# EAGLE design PhotonHome (EAGLE 7.2.0)
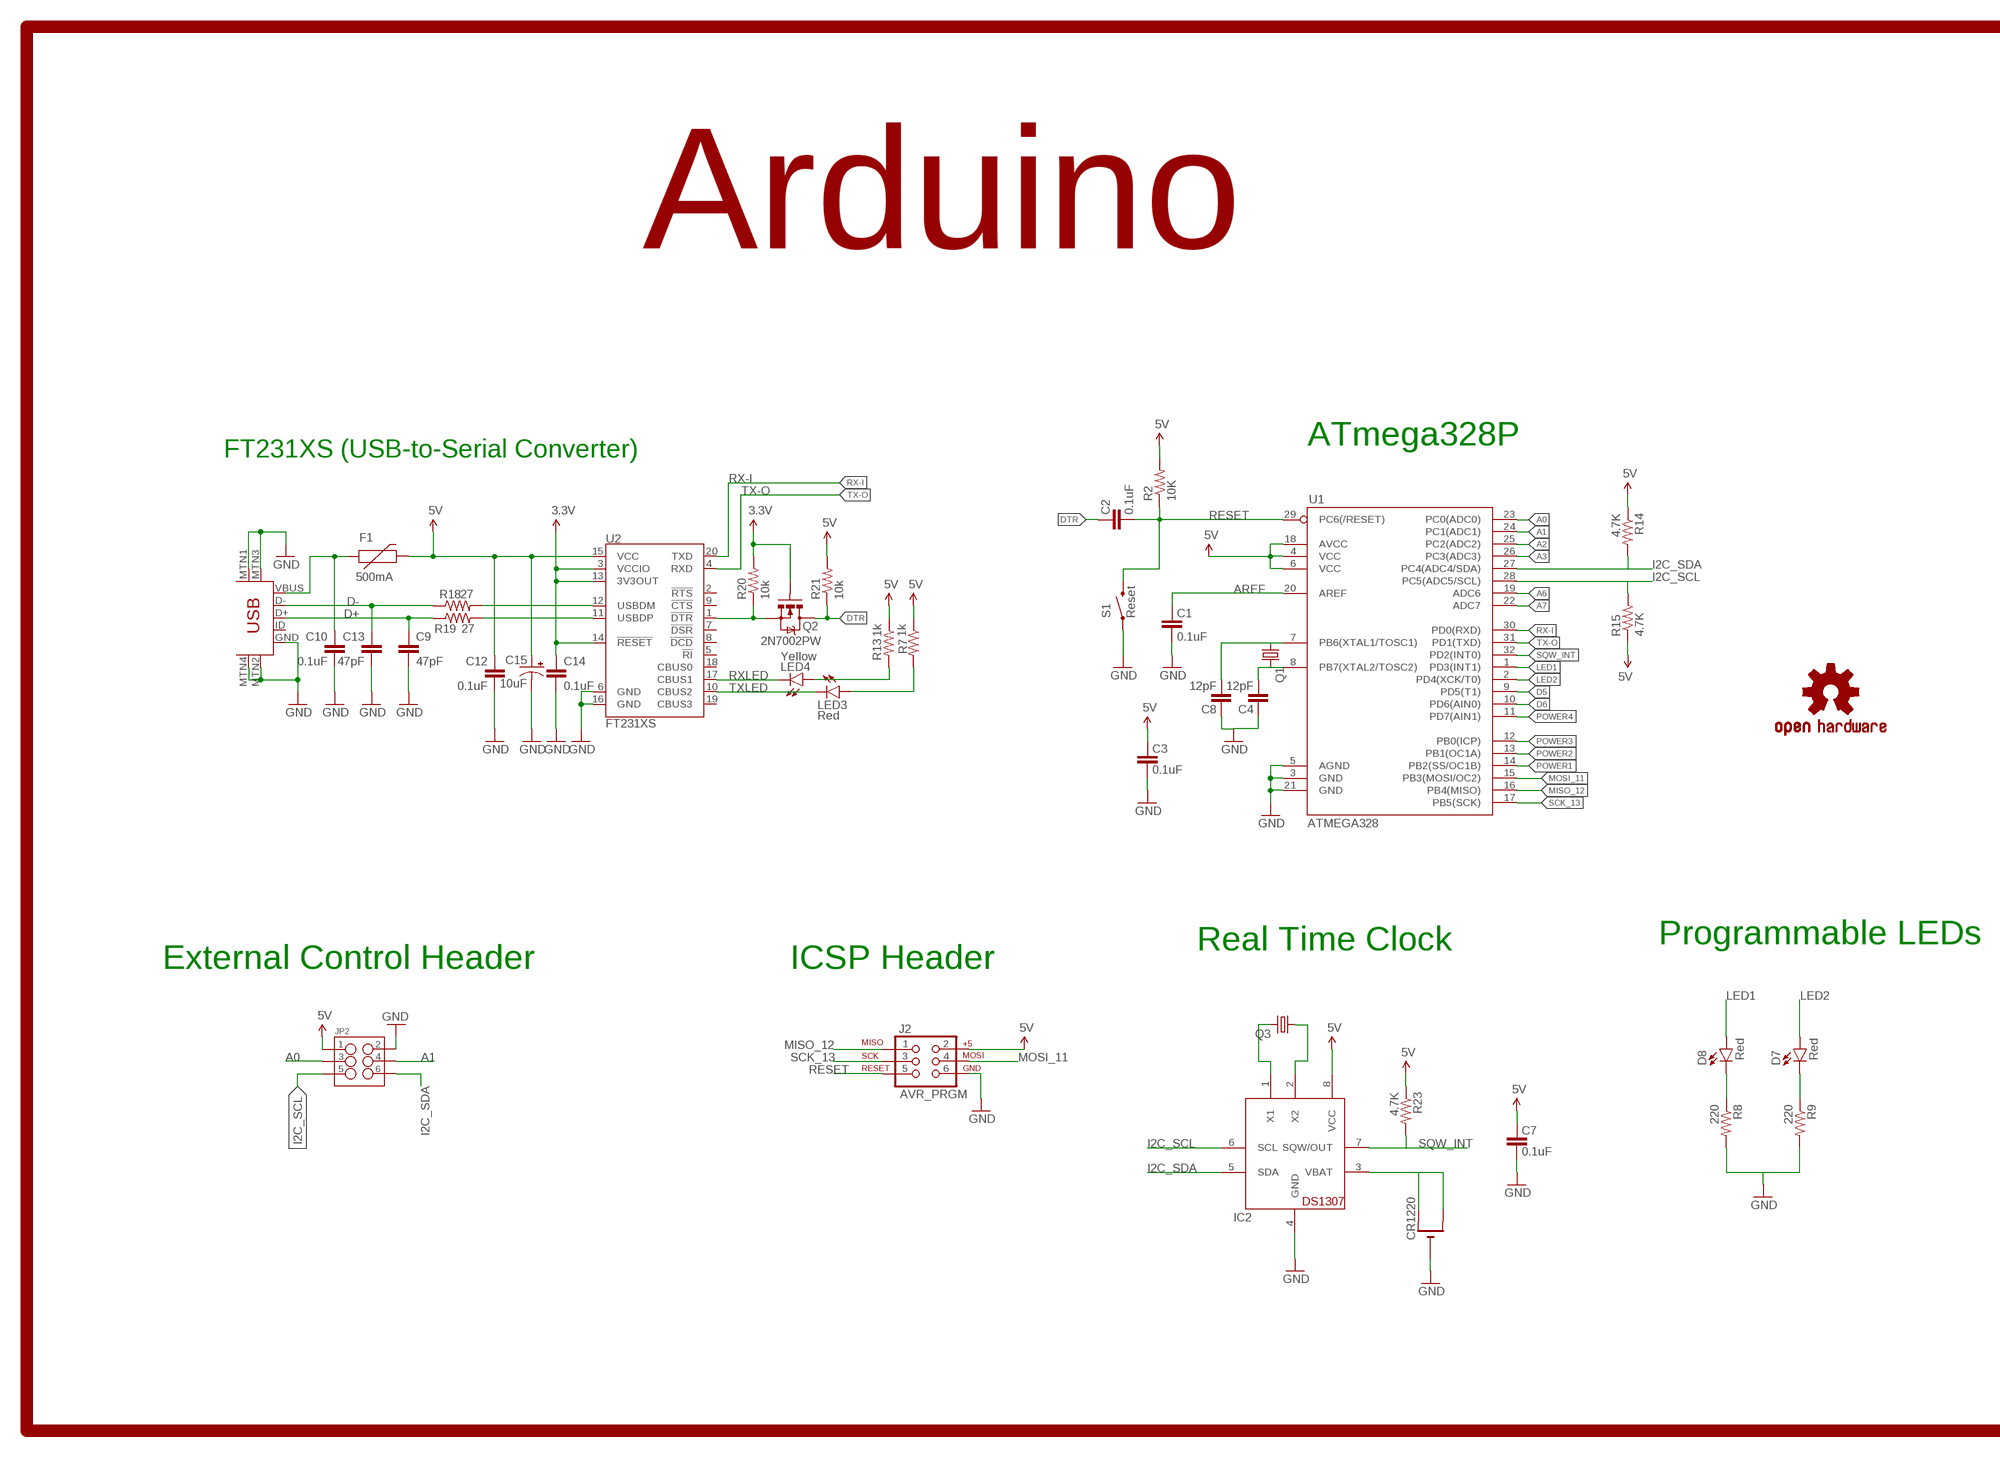
[diagram p0: schematic, sheet 1, part 1 of 2]
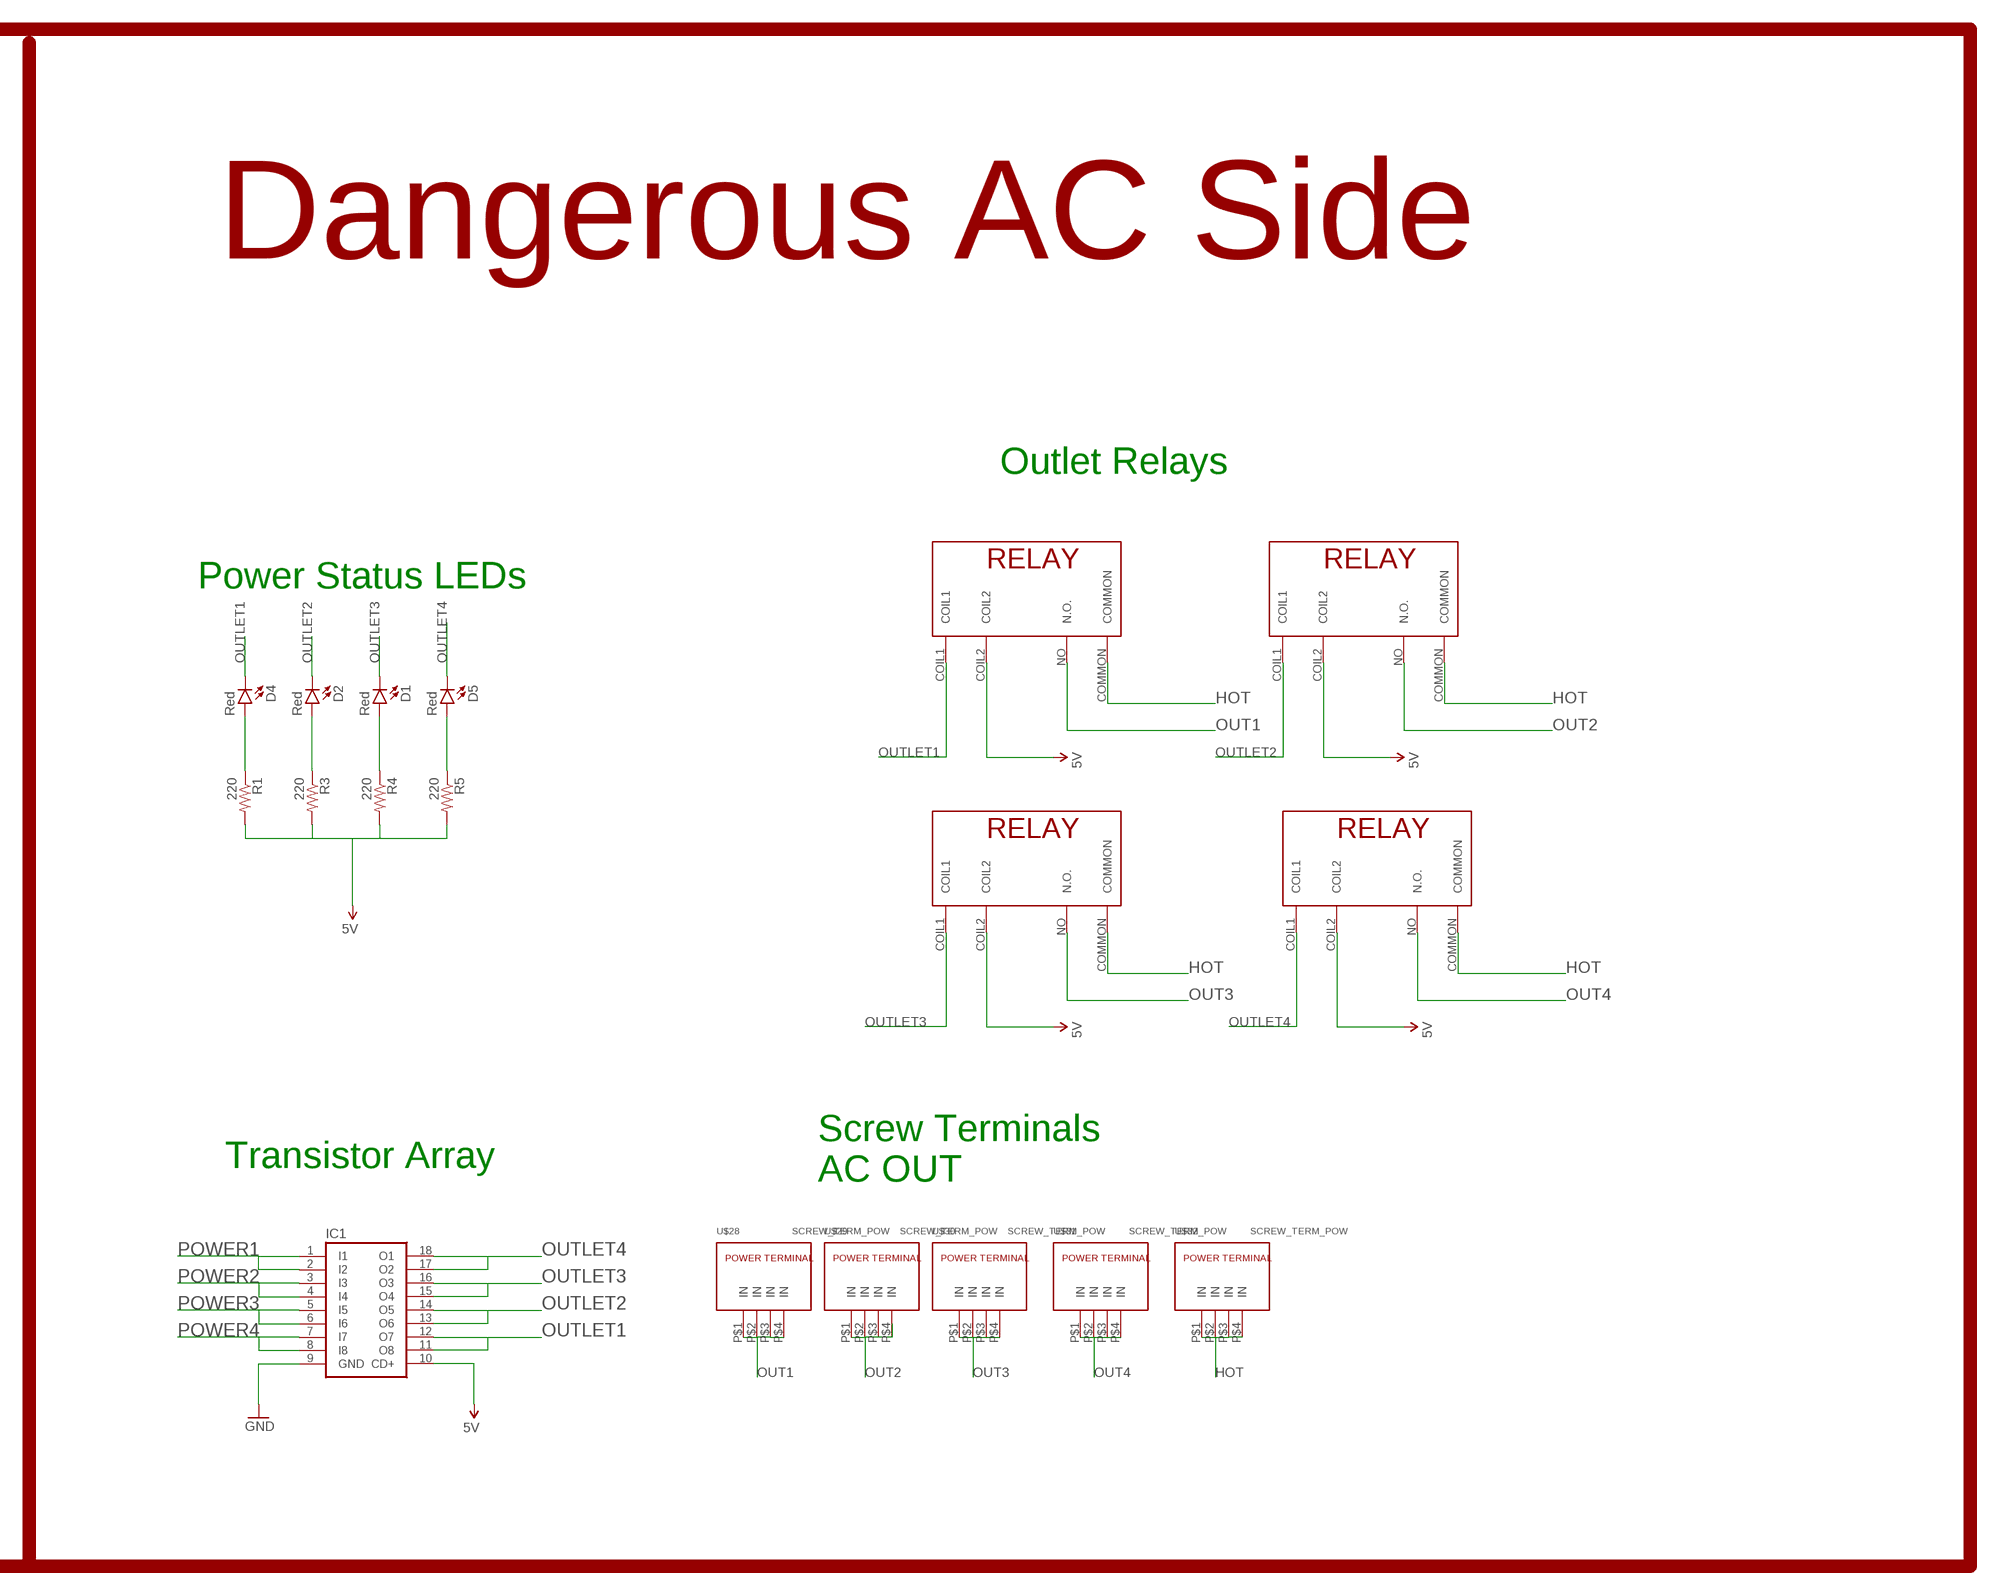
[diagram p1: schematic, sheet 1, part 2 of 2]

## Parts
C1  0.1uF  CAP0805-CAP  [0805-CAP]
C2  0.1uF  CAP0805-CAP  [0805-CAP]
C3  0.1uF  CAP0805-CAP  [0805-CAP]
C4  12pF  CAP0805-CAP  [0805-CAP]
C7  0.1uF  CAP0805-CAP  [0805-CAP]
C8  12pF  CAP0805-CAP  [0805-CAP]
C9  47pF  CAP0805-CAP  [0805-CAP]
C10  0.1uF  CAP0805-CAP  [0805-CAP]
C12  0.1uF  CAP0805-CAP  [0805-CAP]
C13  47pF  CAP0805-CAP  [0805-CAP]
C14  0.1uF  CAP0805-CAP  [0805-CAP]
C15  10uF  CAP_POL1206  [EIA3216]
CR1220  CR1220THM  [CR1220-THM]
D1  Red  LED-RED0805  [0805-LED]
D2  Red  LED-RED0805  [0805-LED]
D4  Red  LED-RED0805  [0805-LED]
D5  Red  LED-RED0805  [0805-LED]
D7  Red  LED-RED0805  [0805-LED]
D8  Red  LED-RED0805  [0805-LED]
F1  500mA  PTCSMD  [PTC-1206]
IC1  ULN2803ASOIC18-W  [SOIC18-W]
IC2  DS1307SO08  [SO08-150MIL]
J2  AVR_PRGM  AVR_SPI_PRG_6PTH  [2X3]
JP2  M03X2SHROUD  [2X3-SHROUDED]
LED3  Red  LED-RED0805  [0805-LED]
LED4  Yellow  LED-RED0805  [0805-LED]
MINIUSB  USB-MINIB-5PIN  [USB-MINIB]
Q1  CRYSTALHC49UP  [HC49UP]
Q2  2N7002PW  MOSFET-NCHANNEL2N7002PW  [SOT323]
Q3  CRYSTALTC38H  [TC38H]
R1  220  RES0805-RES  [0805]
R2  10K  RES0805-RES  [0805]
R3  220  RES0805-RES  [0805]
R4  220  RES0805-RES  [0805]
R5  220  RES0805-RES  [0805]
R7  1k  RES0805-RES  [0805]
R8  220  RES0805-RES  [0805]
R9  220  RES0805-RES  [0805]
R13  1k  RES0805-RES  [0805]
R14  4.7K  RES0805-RES  [0805]
R15  4.7K  RES0805-RES  [0805]
R18  27  RES0805-RES  [0805]
R19  27  RES0805-RES  [0805]
R20  10k  RES0805-RES  [0805]
R21  10k  RES0805-RES  [0805]
R23  4.7K  RES0805-RES  [0805]
RELAY1  RELAY_NO  [RELAY_G2RL-1A]
RELAY2  RELAY_NO  [RELAY_G2RL-1A]
RELAY3  RELAY_NO  [RELAY_G2RL-1A]
RELAY4  RELAY_NO  [RELAY_G2RL-1A]
S1  Reset  SWITCH-MOMENTARY-2SMD-ALT01  [TACTILE-SWITCH-SMD-ALT01]
U1  ATMEGA328  ATMEGA168  [TQFP32-08]
U2  FT231XS  [SSOP20_L]
U$3  OSHW-LOGOS  [OSHW-LOGO-S]
U$28  SCREW_TERM_POW  [SCREW-TERMINAL-POW]
U$29  SCREW_TERM_POW  [SCREW-TERMINAL-POW]
U$30  SCREW_TERM_POW  [SCREW-TERMINAL-POW]
U$31  SCREW_TERM_POW  [SCREW-TERMINAL-POW]
U$32  SCREW_TERM_POW  [SCREW-TERMINAL-POW]

## Nets
3.3V: C14.1 Q2.1(G) R20.2 U2.3(VCCIO) U2.13(3V3OUT) U2.14(!RESET)
5V: C3.2 C7.2 C12.1 C15.A(+) F1.2 IC1.10(CD+) IC2.8(VCC) J2.2 JP2.1 R1.2 R2.2 R3.2 R4.2 R5.2 R7.1 R13.1 R14.1 R15.1 R21.2 R23.1 RELAY1.COIL2 RELAY2.COIL2 RELAY3.COIL2 RELAY4.COIL2 U1.4(VCC) U1.6(VCC) U1.18(AVCC) U2.15(VCC)
A0: JP2.3 U1.23(PC0(ADC0))
A1: JP2.4 U1.24(PC1(ADC1))
A2: U1.25(PC2(ADC2))
A3: U1.26(PC3(ADC3))
A6: U1.19(ADC6)
A7: U1.22(ADC7)
AREF: C1.2 U1.20(AREF)
D5: U1.9(PD5(T1))
D6: U1.10(PD6(AIN0))
D+: C9.1 MINIUSB.D+ R19.1
D-: C13.1 MINIUSB.D- R18.1
DTR: C2.2 Q2.3(D) R21.1
GND [vcc]: C1.1 C3.1 C4.2 C7.1 C8.2 C9.2 C10.2 C12.2 C13.2 C14.2 C15.C(-) CR1220.- IC1.9(GND) IC2.4(GND) J2.6 JP2.2 MINIUSB.GND MINIUSB.MTN1(MTN2) MINIUSB.MTN2(MTN3) MINIUSB.MTN3(MTN1) MINIUSB.MTN4 R8.2 R9.2 S1.1 S1.2 U1.3(GND) U1.5(AGND) U1.21(GND) U2.6(GND) U2.16(GND)
HOT: RELAY1.COMMON RELAY2.COMMON RELAY3.COMMON RELAY4.COMMON U$32.P$1(IN) U$32.P$2(IN) U$32.P$3(IN) U$32.P$4(IN)
I2C_SCL: IC2.6(SCL) JP2.5 R15.2 U1.28(PC5(ADC5/SCL))
I2C_SDA: IC2.5(SDA) JP2.6 R14.2 U1.27(PC4(ADC4/SDA))
LED1: D8.1(A) U1.1(PD3(INT1))
LED2: D7.1(A) U1.2(PD4(XCK/T0))
MISO_12: J2.1 U1.16(PB4(MISO))
MOSI_11: J2.4 U1.15(PB3(MOSI/OC2))
N$1: C4.1 Q1.2 U1.8(PB7(XTAL2/TOSC2))
N$2: C8.1 Q1.1 U1.7(PB6(XTAL1/TOSC1))
N$4: LED3.1(A) R7.2
N$6: D4.1(A) R1.1
N$7: D2.1(A) R3.1
N$8: D1.1(A) R4.1
N$9: D5.1(A) R5.1
N$11: D8.2(C) R8.1
N$12: LED4.1(A) R13.2
N$13: R18.2 U2.12(USBDM)
N$14: D7.2(C) R9.1
N$16: R19.2 U2.11(USBDP)
N$17: Q2.2(S) R20.1 U2.1(!DTR)
N$22: IC2.1(X1) Q3.2
N$23: IC2.2(X2) Q3.1
N$27: CR1220.+1(+) CR1220.+2(+1) IC2.3(VBAT)
OUT1: RELAY1.NO(N.O.) U$28.P$1(IN) U$28.P$2(IN) U$28.P$3(IN) U$28.P$4(IN)
OUT2: RELAY2.NO(N.O.) U$29.P$1(IN) U$29.P$2(IN) U$29.P$3(IN) U$29.P$4(IN)
OUT3: RELAY3.NO(N.O.) U$30.P$1(IN) U$30.P$2(IN) U$30.P$3(IN) U$30.P$4(IN)
OUT4: RELAY4.NO(N.O.) U$31.P$1(IN) U$31.P$2(IN) U$31.P$3(IN) U$31.P$4(IN)
OUTLET1: D4.2(C) IC1.11(O8) IC1.12(O7) RELAY1.COIL1
OUTLET2: D2.2(C) IC1.13(O6) IC1.14(O5) RELAY2.COIL1
OUTLET3: D1.2(C) IC1.15(O4) IC1.16(O3) RELAY3.COIL1
OUTLET4: D5.2(C) IC1.17(O2) IC1.18(O1) RELAY4.COIL1
POWER1: IC1.1(I1) IC1.2(I2) U1.14(PB2(SS/OC1B))
POWER2: IC1.3(I3) IC1.4(I4) U1.13(PB1(OC1A))
POWER3: IC1.5(I5) IC1.6(I6) U1.12(PB0(ICP))
POWER4: IC1.7(I7) IC1.8(I8) U1.11(PD7(AIN1))
RESET: C2.1 J2.5 R2.1 S1.3 S1.4 U1.29(PC6(/RESET))
RX-I: U1.30(PD0(RXD)) U2.20(TXD)
RXLED: LED4.2(C) U2.17(CBUS1)
SCK_13: J2.3 U1.17(PB5(SCK))
SQW_INT: IC2.7(SQW/OUT) R23.2 U1.32(PD2(INT0))
TX-O: U1.31(PD1(TXD)) U2.4(RXD)
TXLED: LED3.2(C) U2.10(CBUS2)
VUSB: C10.1 F1.1 MINIUSB.VBUS
Unconnected: MINIUSB.ID U2.2(!RTS) U2.5(!RI) U2.7(!DSR) U2.8(!DCD) U2.9(!CTS) U2.18(CBUS0) U2.19(CBUS3)

## Notes on the sheet
- Arduino | Dangerous AC Side
- Outlet Relays
- ATmega328P
- FT231XS (USB-to-Serial Converter)
- Power Status LEDs
- Real Time Clock | Programmable LEDs
- External Control Header | ICSP Header
- Transistor Array
- Screw Terminals
  AC OUT

## Library data of the parts
C1-C4 C7-C10 C12-C14 = Terramus:CAP: CAP-08390
C15 = SparkFun-Capacitors:CAP_POL: Capacitor Polarized These are standard SMD and PTH capacitors. Normally 10uF, 47uF, and 100uF in electrolytic and tantalum varieties. Always verify the external diameter of the through hole cap, it varies with capacity, voltage, and manufacturer. The EIA devices should be standard.
CR1220 = Terramus:CR1220: CR1216/CR1220/CR1225 12mm 3V lithium coin cell Great for battery packup. Both SMT and THM holders. Note the THM package has the ground pads on both sides of the PCB so that the masks are the same - this reduces the cost
D1 D2 D4 D5 D7 D8 LED3 LED4 = Terramus:LED-RED: Assorted Red LEDs LilyPad 1206- DIO-09912 1206- DIO-00809 0603- DIO-00819
F1 = SparkFun:PTC: Resettable Fuse PTC Resettable Fuse. Spark Fun Electronics SKU : COM-08357
IC1 = Terramus:ULN2803A: DRIVER ARRAY
IC2 = Terramus:DS1307: DS1307 Real time clock (RTC) with battery backup ability. Talk to it via i2c
J2 = SparkFun-Connectors:AVR_SPI_PRG_6: AVR ISP 6 Pin This is the reduced ISP connector for AVR programming. Common on Arduino. This footprint will take up less PCB space and can be used with a 10-pin to 6-pin adapter such as SKU: BOB-08508 **Special note about "TEST_POINT" package. The stop mask is on the top side, so if you want your programming test points to be on the bottom of your board, make sure to place this package on the bottom side of the board. This also ensure that the orientation to program from the bottom side will be correct.
JP2 = Terramus:M03X2: 2x3 .1" header. Shrouded, with keying- CONN-10681 SMT- CONN-11415 Pogo pins- HW-11044; PROD_ID: CONN-10681
MINIUSB = SparkFun-Connectors:USB-MINIB: Mini-USB "B" connector with 5th pin broken out. Created new symbol breaking out 5th "ID" pin in mini/micro USB connector spec. See: http://en.wikipedia.org/wiki/Mini_usb#Cables. Uses same footprint as 4-pin symbol. Also added pins to connect to mounting / shield pads if required (probably not generally needed as signals aren't shielded once they leave the connector).
Q1 = adafruit:CRYSTAL: CRYSTAL; OC_FARNELL: unknown; OC_NEWARK: unknown
Q2 = SparkFun-DiscreteSemi:MOSFET-NCHANNEL: Common NMOSFET Parts MFG P/N Store ID Prod ID FDD8780 TRANS-09984 SI7820DN TRANS-11055 FDS6630A IC-08089 2N7002PW TRANS-11151 FQP30N06L COM-10213 TRANS-10060 BSS123LT1G TRANS-08345 BSS138 TRANS-00830 BS170 2N7000; PROD_ID: TRANS-11151
Q3 = Terramus:CRYSTAL: CRYSTAL; OC_FARNELL: unknown; OC_NEWARK: unknown
R1-R5 R7-R9 R13-R15 R18-R21 R23 = Terramus:RES: RES-00824
RELAY1-RELAY4 = Terramus:RELAY_NO
S1 = Testing:SWITCH-MOMENTARY-2: Various NO switches- pushbuttons, reed, etc
U1 = SparkFun:ATMEGA168
U2 = SparkFun-DigitalIC:FT231X: FTDI FT231X Full Speed USB to Full-handshake UART This USB2.0 Full Speed IC offers a compact bridge to full handshake UART interfaces. The device is a UART, capable of operating up to 3MBaud, with low power consumption (8mA). The FT231X includes the complete FT-X series feature set and enables USB to be added into a system design quickly and easily over a UART interface.
U$3 = SparkFun:OSHW-LOGO: Open Source Hardware Logo This logo indicates the piece of hardware it is found on incorporates a OSHW license and/or adheres to the definition of open source hardware found here: http://freedomdefined.org/OSHW
U$28-U$32 = Terramus:SCREW_TERM_POW

## Net classes
0 default: width 0.152 mm, drill 0.305 mm, clearance 0.152 mm
1 vcc: width 0.254 mm, clearance 0.205 mm to class 0, clearance 0.205 mm

## Board
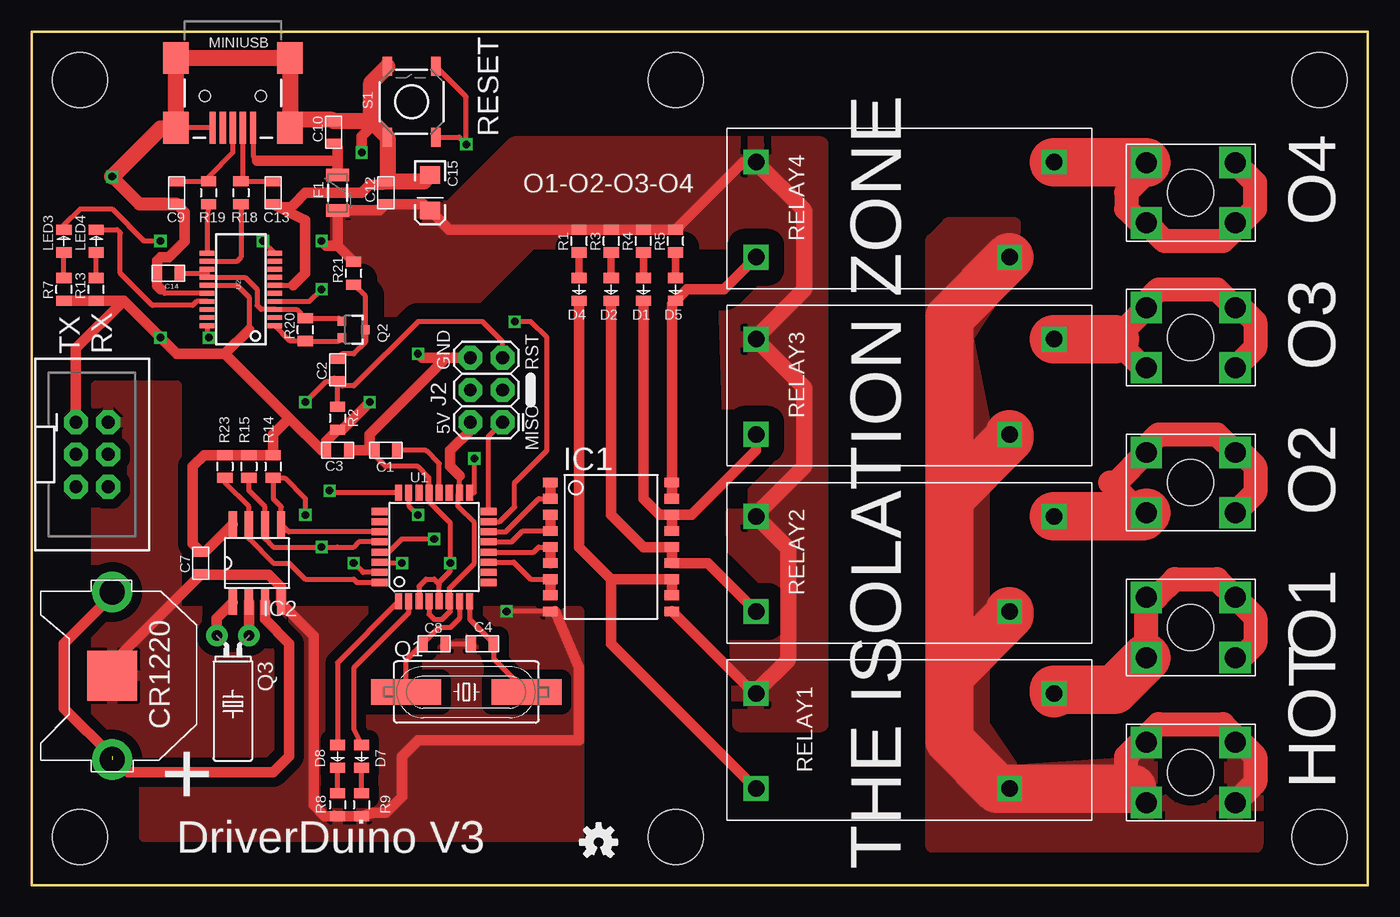
[diagram p2: board, top side]
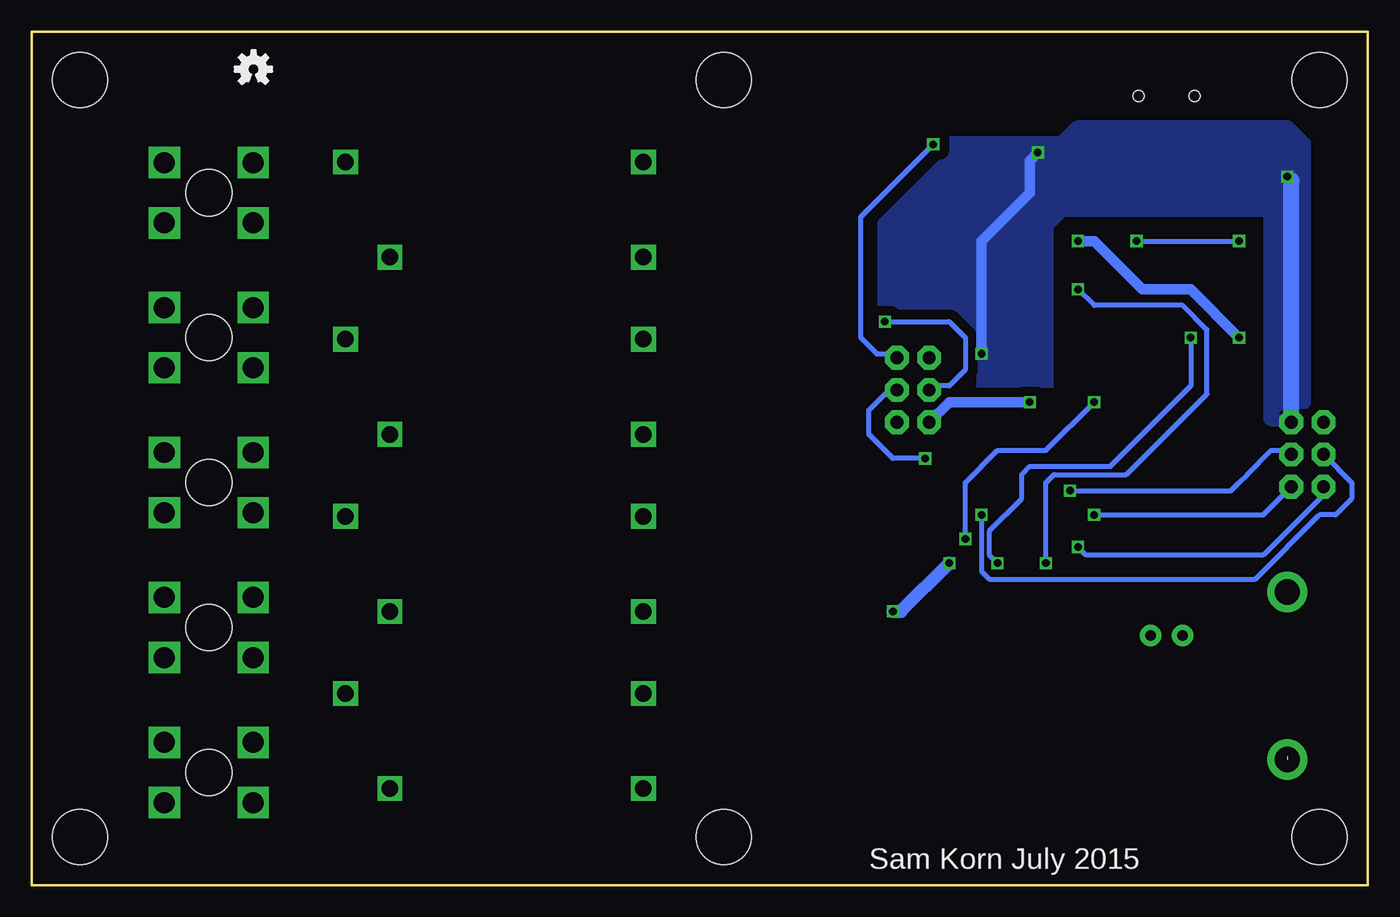
[diagram p3: board, bottom side, seen from below]

Size 105.41 x 67.31 mm. Coordinates in mm from the lower left corner, seen from the top.
Outline: 0,67.31 0,0 105.41,0 105.41,67.31 0,67.31
Copper layers (1*16): Top 0.0356mm / dielectric 1.5011mm / Bottom 0.0356mm
Design rules "LaenPCBOrder": minimum track width 6mil, minimum drill 13mil, track to track 6mil, track to pad 6mil, pad to pad 6mil, via to via 6mil, smd to smd 6mil, copper to edge 15mil, drill to drill 6mil, minimum pad ring 7mil, minimum via ring 7mil, stop-mask expansion 3mil, vias tented up to drill 0mil, thermal gap 10mil
Holes 4.34 mm at 50.8,3.81 50.8,63.5 3.81,63.5 3.81,3.81 101.6,63.5 101.6,3.81

### Footprints (pad centres in the part's own frame; a part is rotated, then mirrored left to right if it is on the bottom)
0805-CAP = smd 0.8 x 1.2: 1 -0.9,0; 2 0.9,0
EIA3216 = smd 1.4 x 1.6: A 1.4,0; C -1.4,0
CR1220-THM = drill 2 pad 3.175: +1 -6.604,0; +2 6.604,0 | smd 3.962 x 3.962: - 0,0
0805-LED = smd 0.8 x 1.2: 1 -0.9,0; 2 0.9,0
PTC-1206 = smd 1 x 1.8: 1 -1.4,0; 2 1.4,0
SOIC18-W = smd 0.762 x 1.143: 1 -5.08,-4.788; 2 -3.81,-4.788; 3 -2.54,-4.788; 4 -1.27,-4.788; 5 0,-4.788; 6 1.27,-4.788; 7 2.54,-4.788; 8 3.81,-4.788; 9 5.08,-4.788; 10 5.08,4.788; 11 3.81,4.788; 12 2.54,4.788; 13 1.27,4.788; 14 0,4.788; 15 -1.27,4.788; 16 -2.54,4.788; 17 -3.81,4.788; 18 -5.08,4.788
SO08-150MIL = smd 0.66 x 2.032: 1 -1.905,-3.073; 2 -0.635,-3.073; 3 0.635,-3.073; 4 1.905,-3.073; 5 1.905,3.073; 6 0.635,3.073; 7 -0.635,3.073; 8 -1.905,3.073
2X3 = drill 1.016 pad 1.88 octagon: 1 0,0; 2 0,2.54; 3 2.54,0; 4 2.54,2.54; 5 5.08,0; 6 5.08,2.54
2X3-SHROUDED = drill 1.016 pad 1.88 octagon: 1 -1.27,2.54; 2 1.27,2.54; 3 -1.27,0; 4 1.27,0; 5 -1.27,-2.54; 6 1.27,-2.54
USB-MINIB = smd 2.5 x 0.5: D+ 2.5,0; D- 2.5,0.8; GND 2.5,-1.6; ID 2.5,-0.8; VBUS 2.5,1.6 | smd 2.5 x 2: MTN1 -3,4.5; MTN2 2.5,4.5; MTN3 -3,-4.5; MTN4 2.5,-4.5 | hole 0.9: 0,2.2; 0,-2.2
HC49UP = smd 5.5 x 2: 1 -4.75,0; 2 4.75,0
SOT323 = smd 0.7 x 0.7: 1 -0.65,-0.925; 2 0.65,-0.925; 3 0,0.925
TC38H = drill 0.813 pad 1.676: 1 -1.27,0; 2 1.27,0
0805 = smd 0.8 x 1.2: 1 -0.9,0; 2 0.9,0
RELAY_G2RL-1A = drill 1.3 square: COIL1 0,0; COIL2 0,7.5; COMMON 20,0; NO 23.5,7.5
TACTILE-SWITCH-SMD-ALT01 = smd 1.524 x 0.762: 1 -2.794,1.905; 2 2.794,1.905; 3 -2.794,-1.905; 4 2.794,-1.905
TQFP32-08 = smd 1.27 x 0.559: 1 -4.293,2.8; 2 -4.293,2; 3 -4.293,1.2; 4 -4.293,0.4; 5 -4.293,-0.4; 6 -4.293,-1.2; 7 -4.293,-2; 8 -4.293,-2.8; 17 4.293,-2.8; 18 4.293,-2; 19 4.293,-1.2; 20 4.293,-0.4; 21 4.293,0.4; 22 4.293,1.2; 23 4.293,2; 24 4.293,2.8 | smd 0.559 x 1.27: 9 -2.8,-4.293; 10 -2,-4.293; 11 -1.2,-4.293; 12 -0.4,-4.293; 13 0.4,-4.293; 14 1.2,-4.293; 15 2,-4.293; 16 2.8,-4.293; 25 2.8,4.293; 26 2,4.293; 27 1.2,4.293; 28 0.4,4.293; 29 -0.4,4.293; 30 -1.2,4.293; 31 -2,4.293; 32 -2.8,4.293
SSOP20_L = smd 0.381 x 1.143: 1 -2.857,-2.68; 2 -2.223,-2.68; 3 -1.587,-2.68; 4 -0.953,-2.68; 5 -0.318,-2.68; 6 0.318,-2.68; 7 0.953,-2.68; 8 1.587,-2.68; 9 2.223,-2.68; 10 2.857,-2.68; 11 2.857,2.68; 12 2.223,2.68; 13 1.587,2.68; 14 0.953,2.68; 15 0.318,2.68; 16 -0.318,2.68; 17 -0.953,2.68; 18 -1.587,2.68; 19 -2.223,2.68; 20 -2.857,2.68
SCREW-TERMINAL-POW = drill 1.651 square: P$1 -2.375,-3.505; P$2 2.375,-3.505; P$3 -2.375,3.505; P$4 2.375,3.505 | hole 3.658: 0,0

### Placement (x,y rotation side)
C1  27.94,34.29 0 top
C2  24.13,40.64 90 top
C3  24.13,34.29 180 top
C4  35.56,19.05 180 top
C7  13.34,25.4 90 top
C8  31.75,19.05 0 top
C9  11.43,54.61 270 top
C10  23.81,59.37 90 top
C12  27.94,54.61 90 top
C13  19.05,54.61 270 top
C14  10.79,48.26 180 top
C15  31.43,54.61 270 top
CR1220  6.35,16.51 90 top
D1  48.26,46.99 270 top
D2  45.72,46.99 270 top
D4  43.18,46.99 270 top
D5  50.8,46.99 270 top
D7  26.04,10.16 270 top
D8  24.13,10.16 270 top
F1  24.13,54.61 270 top
IC1  45.72,26.67 270 top
IC2  17.78,25.4 0 top
J2  37.15,36.51 90 top
JP2  4.76,33.97 0 top
LED3  2.54,50.8 90 top
LED4  5.08,50.8 90 top
MINIUSB  15.88,62.23 270 top
Q1  34.29,15.24 0 top
Q2  25.4,43.81 270 top
Q3  15.88,19.68 180 top
R1  43.18,50.8 90 top
R2  24.13,36.83 270 top
R3  45.72,50.8 90 top
R4  48.26,50.8 90 top
R5  50.8,50.8 90 top
R7  2.54,46.99 90 top
R8  24.13,6.35 270 top
R9  26.04,6.35 270 top
R13  5.08,46.99 90 top
R14  19.05,33.02 270 top
R15  17.14,33.02 270 top
R18  16.51,54.61 270 top
R19  13.97,54.61 270 top
R20  21.59,43.81 90 top
R21  25.4,48.26 90 top
R23  15.24,33.02 270 top
RELAY1  57.15,7.62 0 top
RELAY2  57.15,21.59 0 top
RELAY3  57.15,35.56 0 top
RELAY4  57.15,49.53 0 top
S1  29.97,61.79 90 top
U1  31.75,26.67 90 top
U2  16.51,46.99 90 top
U$1  OSHW-LOGOS  [OSHW-LOGO-S]  44.73,3.39 0 top
U$3  87.91,64.35 0 bottom
U$28  91.44,20.32 90 top
U$29  91.44,31.75 90 top
U$30  91.44,43.18 90 top
U$31  91.44,54.61 90 top
U$32  91.44,8.89 90 top

### Tracks (layer width: path | path; a pad name or v marks a point on that pad's centre or on a via)
3.3V
  Top 0.406: U2.13 U2.14 | U2.14 16.83,47.94 17.78,46.99 17.78,45.72 18.1,45.4 U2.3 20.9,45.4 R20.2 24.23,44.72 Q2.1 | C14.1 13.51,48.26 U2.14
5V  (via drill 0.6)
  Top 0.406: 30.93,53.71 C15.A | 56.98,15.12 RELAY1.COIL2 | 56.13,57.03 RELAY4.COIL2 | U2.15 16.19,47.31 17.14,46.35 17.14,43.81 | U1.4 31.35,21.36 31.75,20.95 32.38,20.95 33.02,21.59 33.02,22.31 U1.6 32.95,23.43 34.92,25.4 34.92,28.57 33.66,29.84 33.66,30.87 U1.18 33.75,32.29 | C7.2 13.7,26.3 | 22.86,34.29 C3.2 23.23,35.03 | R2.2 24.5,35.93
  Top 0.813: 24.13,50.43 F1.2 27.44,53.21 C12.1 30.93,53.71 | 24.13,50.43 R21.2 | IC1.10 56.98,15.12 | 56.13,57.03 R5.2 R4.2 R3.2 R1.2 32.94,51.7 C15.A | R7.1 R13.1 7.25,46.09 | 7.25,46.09 v10.16,43.18 11.43,41.91 15.24,41.91 | 15.24,41.91 17.14,43.81 | 15.24,41.91 20.32,36.83 | JP2.1 3.49,42.33 7.25,46.09 | 13.7,26.3 IC2.8 | 20.32,36.83 19.05,35.56 R14.1 R15.1 R23.1 13.6,33.92 12.7,33.02 12.7,26.93 C7.2 | 24.13,50.43 23.23,50.43 v22.86,50.8 | 22.86,34.29 20.32,36.83 | 23.23,35.03 R2.2 | J2.2 34.61,35.88 33.02,34.29 33.02,33.02 33.75,32.29 | 24.5,35.93 v26.67,38.1
  Top 1.27: RELAY1.COIL2 57.15,15.24 59.69,17.78 59.69,26.55 RELAY2.COIL2 57.15,29.21 60.96,33.02 60.96,39.25 RELAY3.COIL2 57.15,43.18 60.96,46.99 60.96,53.22 RELAY4.COIL2
  Bottom 0.813: v22.86,50.8 21.59,50.8 17.78,46.99 13.97,46.99 v10.16,43.18 | v26.67,38.1 33.02,38.1 J2.2
  pour Top (isolate 1.27): 55.88,12.7 62.23,12.7 62.23,58.42 38.1,58.42 33.02,53.34 24.13,53.34 24.13,50.8 27.94,46.99 27.94,44.45 33.02,44.45 39.37,50.8 54.61,50.8
A0  (via drill 0.6)
  Top 0.406: U1.23 29.75,29.94 v30.48,29.21
  Bottom 0.406: JP2.3 1.27,31.75 1.27,30.48 2.54,29.21 3.81,29.21 8.89,24.13 29.84,24.13 30.48,24.77 v30.48,29.21
A1  (via drill 0.6)
  Top 0.406: U1.24 23.65,30.96 v23.5,31.11
  Bottom 0.406: JP2.4 6.35,34.29 7.62,34.29 9.53,32.38 10.16,31.75 10.79,31.11 v23.5,31.11
AREF
  Top 0.406: U1.20 32.15,33.26 31.11,34.29 C1.2
D+
  Top 0.406: C9.1 R19.1 | R19.1 13.6,55.51 | MINIUSB.D+ 15.88,57.78 13.97,55.88 R19.1
D-
  Top 0.406: C13.1 R18.1 16.68,55.67 MINIUSB.D-
DTR
  Top 0.406: R21.1 26.32,46.44 Q2.3 26.32,42.84 25.4,41.91 24.5,41.91 C2.2
GND  (via drill 0.6)
  Top 0.406: MINIUSB.GND MINIUSB.MTN4 11.38,60.96 | 28.07,55.64 C12.2 | 41.27,21.59 IC1.9 v37.47,21.59 | CR1220.- 6.35,17.52 | IC2.4 19.68,22.23 | 23.86,5.71 R8.2 | 26.67,34.66 C1.1 27.04,33.92 27.94,33.02 30.48,33.02 31.35,32.15 U1.21 31.35,30.25 33.02,28.57 v33.02,25.4 33.02,24.77 32.15,23.89 32.15,23.73 | U2.6 20.64,47.31 | C13.2 20.69,53.71 | 30.8,41.59 v30.48,41.91 | U1.5 32.15,23.73 | 32.15,23.73 31.75,24.13 31.11,24.13 30.55,23.57 U1.3 | U2.16 10.48,46.67 10.16,46.99 | C8.2 C4.2
  Top 0.61: 23.72,60.37 C10.2 | 26.79,60.27 27.02,60.04
  Top 0.813: C3.1 C1.1 | 41.27,21.59 43.18,17.14 43.18,11.43 30.48,11.43 29.21,10.16 29.21,6.99 27.94,5.71 26.93,5.71 R9.2 R8.2 23.12,5.45 22.23,6.35 22.23,19.68 19.68,22.23 | IC2.4 19.68,23.5 18.68,24.5 C7.1 6.35,17.52 | J2.6 32.7,41.59 | 32.7,41.59 26.67,35.56 26.67,34.66 | 20.64,47.31 21.59,48.26 21.59,52.44 C13.2 | 20.69,53.71 21.59,54.61 26.04,54.61 26.67,55.24 27.68,55.24 C12.2 | 32.7,41.59 30.8,41.59 | v26.04,57.78 26.04,59.05 27.02,60.04 | 7.62,57.15 7.62,57.2 | C9.2 12.06,53.08 12.06,50.8 10.79,49.53 10.16,49.53 9.89,49.27 C14.2 9.89,47.26 10.16,46.99
  Top 1.016: C9.2 8.52,53.71 v6.35,55.88 | 7.62,57.2 7.67,57.2 | 11.34,59.69 MINIUSB.MTN4 | 21,60.37 20.32,59.69
  Top 1.27: MINIUSB.MTN2 MINIUSB.MTN1 MINIUSB.MTN3 11.38,60.96 | C10.2 26.79,60.27 26.79,63.3 S1.2 | 27.02,60.04 S1.1 28.07,55.64 | C12.2 30.93,55.51 C15.C | 7.62,57.15 v6.35,55.88 | 7.67,57.2 10.16,59.69 11.34,59.69 | 23.72,60.37 21,60.37
  Bottom 0.813: 6.03,55.56 v6.35,55.88 | v30.48,41.91 30.48,50.8 26.67,54.61 26.67,57.15 v26.04,57.78
  Bottom 1.016: v37.47,21.59 36.83,21.59 v33.02,25.4
  Bottom 1.27: JP2.2 6.03,55.56
  pour Top (isolate 0.762): 5.08,39.37 5.08,7.62 8.89,7.62 8.89,3.81 43.18,3.81 43.18,21.59 11.43,21.59 11.43,39.37
  pour Bottom (isolate 0.762): 22.86,58.42 33.02,58.42 33.02,57.15 38.1,52.07 38.1,44.45 33.02,44.45 31.75,43.18 31.75,39.37 25.4,39.37 25.4,52.07 22.86,54.61
  pour Bottom (isolate 0.762): 24.13,53.34 5.08,53.34 5.08,58.42 6.35,59.69 22.86,59.69 24.13,58.42
  pour Bottom (isolate 0.762): 7.62,36.83 6.35,36.83 5.08,38.1 5.08,53.34 7.62,53.34
HOT
  Top 1.905: U$32.P$3 87.94,7.32 86.36,8.89 86.36,10.16 87.63,11.43 87.77,11.43 U$32.P$4 87.94,11.73 88.9,12.7 93.98,12.7 95.25,11.43 95.11,11.43 U$32.P$2 95.42,11.27 96.52,10.16 96.52,8.09 U$32.P$1
  Top 3.81: 86.83,7.62 RELAY1.COMMON 76.2,7.62 72.39,11.43 72.39,16.51 | 72.39,16.51 72.39,30.48 | 72.39,30.48 72.39,44.77 RELAY4.COMMON | RELAY3.COMMON 77.15,35.24 72.39,30.48 | RELAY2.COMMON 77.15,21.27 72.39,16.51
  pour Top (isolate 0.762): 77.47,8.89 96.52,10.16 96.52,3.17 71.12,3.17 71.12,50.8 72.39,52.07 77.47,52.07 76.2,46.99 73.66,43.18 74.93,36.83 74.93,12.7
I2C_SCL  (via drill 0.6)
  Top 0.406: R15.2 17.14,31.11 18.41,29.84 IC2.6 18.41,27.3 19.05,26.67 v22.86,26.67 24.13,26.67 25.4,26.67 25.8,27.07 U1.28
  Bottom 0.406: JP2.5 3.49,30.8 8.26,26.04 22.23,26.04 v22.86,26.67
I2C_SDA  (via drill 0.6)
  Top 0.406: U1.27 20.29,27.87 IC2.5 19.68,29.84 19.05,30.48 R14.2 19.95,32.12 21.59,30.48 v21.59,29.21
  Bottom 0.406: v21.59,29.21 8.26,29.21 JP2.6
LED1
  Top 0.406: U1.1 24.13,17.56 D8.1
LED2
  Top 0.406: U1.2 29.75,21.5 25.4,17.14 25.4,12.33 D7.1
MISO_12
  Top 0.406: U1.16 36.04,35.41 J2.1
MOSI_11  (via drill 0.6)
  Top 0.406: v38.1,44.45 39.37,44.45 40.64,43.18 40.64,34.29 38.1,31.75 38.1,29.84 36.92,28.67 U1.15
  Bottom 0.406: v38.1,44.45 33.02,44.45 31.75,43.18 31.75,40.64 33.02,39.37 34.29,39.37 J2.4
N$1
  Top 0.406: U1.8 34.55,20.96 C4.1 36.46,17.82 Q1.2
N$2
  Top 0.406: Q1.1 29.54,17.74 C8.1 32.12,20.32 33.02,20.32 33.75,21.05 U1.7
N$4
  Top 0.406: R7.2 LED3.1
N$6
  Top 0.61: D4.1 R1.1
N$7
  Top 0.61: D2.1 R3.1
N$8
  Top 0.61: D1.1 R4.1
N$9
  Top 0.61: D5.1 R5.1
N$11
  Top 0.406: R8.1 D8.2
N$12
  Top 0.406: R13.2 LED4.1
N$13
  Top 0.406: R18.2 16.51,49.53 16.19,49.21 U2.12
N$14
  Top 0.406: R9.1 D7.2
N$16
  Top 0.406: R19.2 13.83,52.58 U2.11
N$17
  Top 0.406: Q2.2 24.23,42.91 R20.1 20.41,42.91 U2.1
N$22
  Top 0.813: Q3.2 14.61,21.06 IC2.1
N$23
  Top 0.813: Q3.1 IC2.2
N$27  (1 unrouted)
  Top 0.813: IC2.3 18.41,20.95 20.32,19.05 20.32,10.16 19.05,8.89 7.62,8.89 6.99,9.53 6.35,10.16 2.54,13.97 2.54,19.05 6.35,22.86 CR1220.+2
OUT1
  Top 1.905: U$28.P$3 U$28.P$4 88.73,22.7 90.17,24.13 93.51,24.13 U$28.P$2 96.52,21.12 96.52,19.05 95.42,17.95 U$28.P$1
  Top 3.81: RELAY1.NO 80.65,15.41 85.4,15.41 U$28.P$3
OUT2
  Top 1.905: U$29.P$3 87.47,29.38 85.09,31.75 85.56,31.75 U$29.P$4 87.94,34.59 88.9,35.56 93.51,35.56 U$29.P$2 95.42,34.12 96.52,33.02 96.52,30.95 U$29.P$1
  Top 3.81: RELAY2.NO 87.65,29.09 U$29.P$3
OUT3
  Top 1.905: U$30.P$3 87.69,40.8 85.44,43.06 U$30.P$4 87.94,46.02 88.9,46.99 93.51,46.99 U$30.P$2 95.42,45.55 96.52,44.45 96.52,42.38 U$30.P$1
  Top 3.81: RELAY3.NO 85.44,43.06
OUT4
  Top 1.905: U$31.P$4 87.94,56.19 86.36,54.61 86.36,53.34 87.63,52.07 87.77,52.07 U$31.P$3 89.37,50.8 93.98,50.8 94.94,51.77 U$31.P$1 95.42,52.23 96.52,53.34 96.52,55.41 U$31.P$2
  Top 3.81: RELAY4.NO 87.89,57.03 U$31.P$4
OUTLET1
  Top 0.813: IC1.11 IC1.12 45.72,24.13 | D4.2 43.18,26.67 45.72,24.13 | RELAY1.COIL1 45.72,19.05 45.72,24.13
OUTLET2
  Top 0.813: D2.2 45.72,29.21 48.26,26.67 IC1.14 IC1.13 53.34,25.4 RELAY2.COIL1
OUTLET3
  Top 0.813: IC1.16 IC1.15 | RELAY3.COIL1 57.15,34.29 52.07,29.21 IC1.16 | D1.2 48.26,30.48 49.53,29.21 IC1.16
OUTLET4
  Top 0.406: D5.2 50.51,45.8
  Top 0.813: IC1.17 IC1.18 50.51,45.8 | D5.2 51.7,46.99 54.61,46.99 RELAY4.COIL1
POWER1
  Top 0.406: 40.64,30.48 IC1.2 40.01,30.48 37.4,27.87 U1.14
  Top 0.813: IC1.1 IC1.2
POWER2
  Top 0.406: U1.13 37.87,27.07 38.73,27.94 IC1.4
  Top 0.813: IC1.3 IC1.4
POWER3
  Top 0.406: U1.12 39.6,26.27 40.01,26.67 IC1.5
  Top 0.813: IC1.5 IC1.6
POWER4
  Top 0.406: 40.67,23.87 IC1.7 39.37,24.13 38.03,25.47 U1.11
  Top 0.813: IC1.7 IC1.8
RESET  (via drill 0.6)
  Top 0.406: S1.4 34.29,62.17 v34.29,58.42 33.72,58.99 S1.3 | R2.1 C2.1 | J2.5 37.15,42.86 35.56,44.45 30.48,44.45 25.4,39.37 24.5,39.37 C2.1 | 23.86,40.01 C2.1 | v31.75,27.3 29.21,27.3 28.18,26.27 U1.29 | v21.59,38.1 23.23,39.74 C2.1
  Bottom 0.406: J2.5 37.47,41.91 38.73,41.91 40.01,43.18 40.01,52.7 v34.29,58.42 | v31.75,27.3 31.75,31.75 29.21,34.29 25.4,34.29 v21.59,38.1
RX-I  (via drill 0.6)
  Top 0.406: U2.20 13.83,43.32 v13.97,43.18 | v29.21,25.4 27.53,25.4 U1.30
  Bottom 0.406: v13.97,43.18 13.97,39.37 20.32,33.02 26.67,33.02 27.3,32.38 27.3,30.48 29.84,27.94 29.84,26.04 v29.21,25.4
RXLED
  Top 0.406: LED4.2 6.72,51.7 6.99,51.44 6.99,48.26 9.53,45.72 12.7,45.72 13.02,46.04 U2.17
SCK_13  (via drill 0.6)
  Top 0.406: U1.17 34.92,30.96 v34.92,33.66
  Bottom 0.406: v34.92,33.66 37.47,33.66 39.37,35.56 39.37,37.47 38.1,38.73 37.47,38.73 J2.3
SQW_INT
  Top 0.406: R23.2 15.24,31.75 17.14,29.84 IC2.7 17.14,27.3 19.05,25.4 20.32,25.4 21.59,24.13 25.4,24.13 25.66,23.87 U1.32
TX-O  (via drill 0.6)
  Top 0.406: U1.31 26.13,24.67 v25.4,25.4 | U2.4 21.91,46.04 v22.86,46.99
  Bottom 0.406: v22.86,46.99 21.59,45.72 14.61,45.72 12.7,43.81 12.7,38.73 19.05,32.38 24.77,32.38 25.4,31.75 v25.4,25.4
TXLED  (via drill 0.6)
  Top 0.406: v18.24,50.8 U2.10 | LED3.2 2.54,52.07 3.81,53.34 6.35,53.34 8.89,50.8 v10.16,50.8
  Bottom 0.406: v18.24,50.8 v10.16,50.8
VUSB
  Top 0.406: MINIUSB.VBUS 17.48,57.45 17.78,57.15
  Top 0.813: F1.1 24.13,57.15 | 24.13,57.15 24.13,58.16 C10.1 | 17.78,57.15 24.13,57.15

### Text on the board
tPlace: RESET | O1-O2-O3-O4 | O4 | TX | RX | GND | RST | O3 | 5V | MISO | O2 | O1 | HOT | + | DriverDuino V3 | THE ISOLATION ZONE
bPlace: Sam Korn July 2015